# Altium schematic sheet Power_Board_R1.SchDoc
size C; SheetNumber: 2; SheetTotal: 2
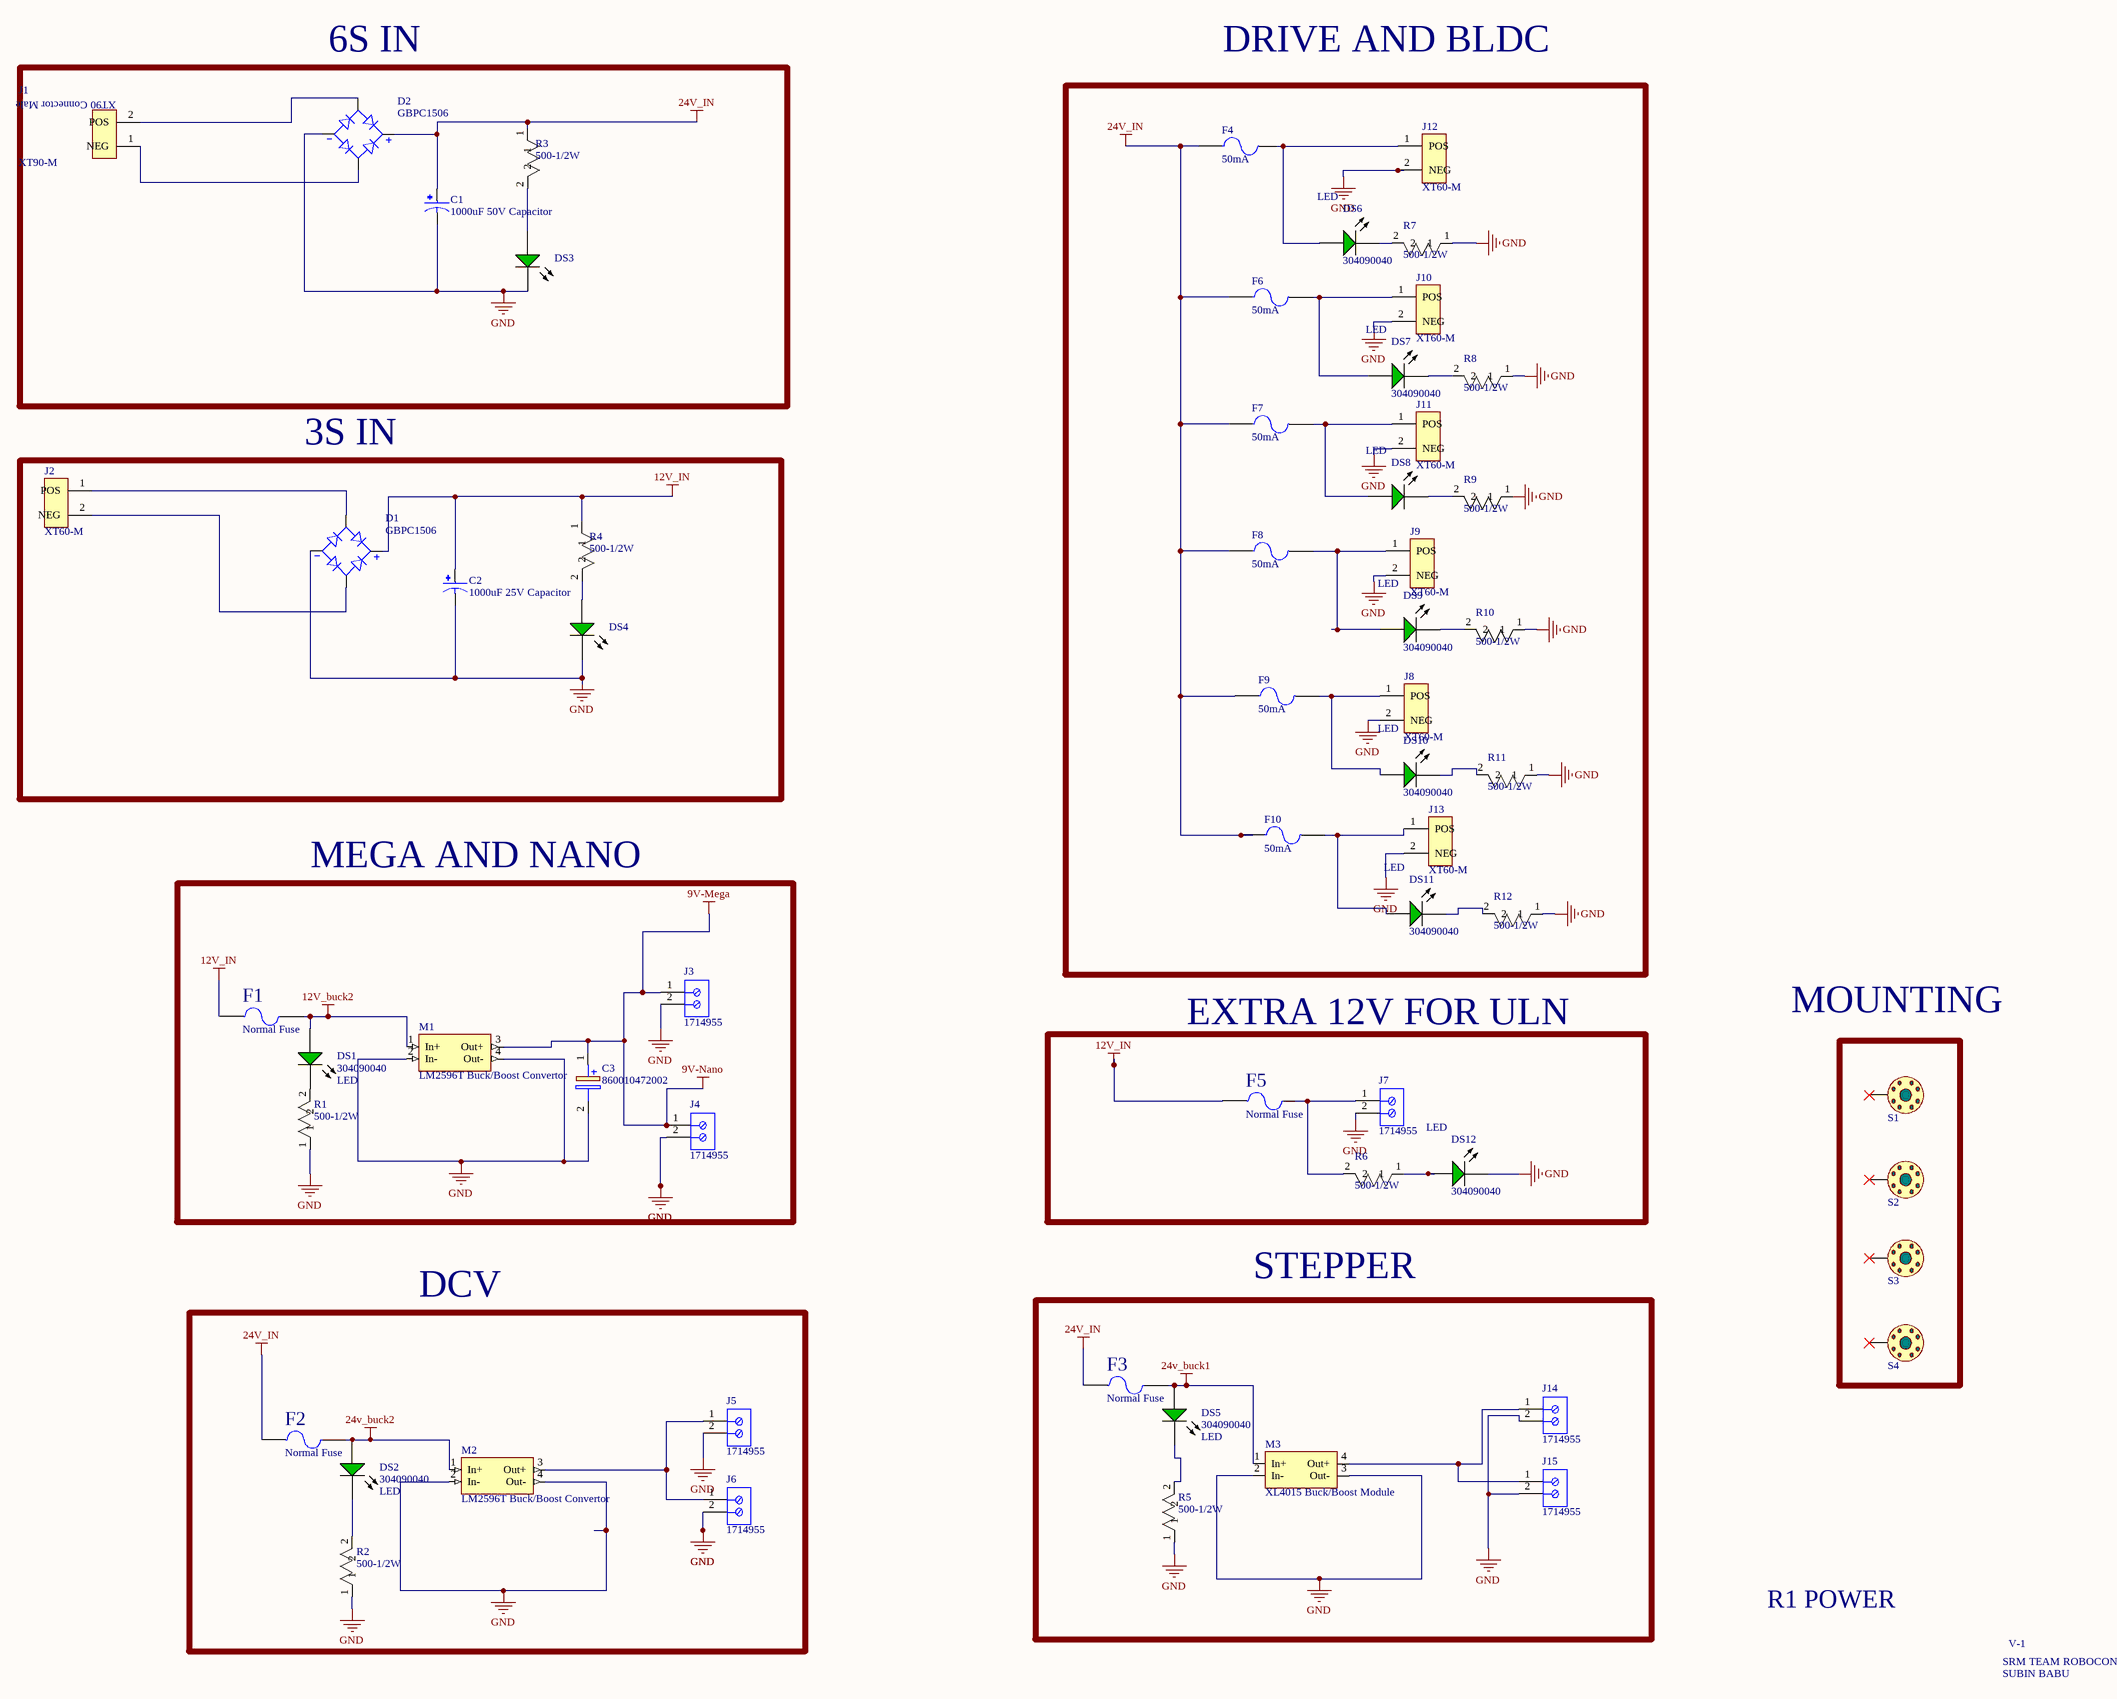
[diagram p0: Power_Board_R1.SchDoc]

## Parts
C1  1000uF 50V Capacitor  [1000uF 50V Capacitor]
C2  1000uF 25V Capacitor  [1000uF 25V Capacitor]
C3  860010472002  [CAPPRD200W52D500H1250]
D1  GBPC1506  [DIOB_GBPC1506]
D2  GBPC1506  [DIOB_GBPC1506]
DS1  304090040  Component Type: LED  [LED-2P-2.28-3MM]
DS2  304090040  Component Type: LED  [LED-2P-2.28-3MM]
DS3  (no value)  [LED-2P-2.28-3MM]
DS4  (no value)  [LED-2P-2.28-3MM]
DS5  304090040  Component Type: LED  [LED-2P-2.28-3MM]
DS6  304090040  Component Type: LED  [LED-2P-2.28-3MM]
DS7  304090040  Component Type: LED  [LED-2P-2.28-3MM]
DS8  Component Type: LED  [LED-2P-2.28-3MM]
DS9  304090040  Component Type: LED  [LED-2P-2.28-3MM]
DS10  304090040  Component Type: LED  [LED-2P-2.28-3MM]
DS11  304090040  Component Type: LED  [LED-2P-2.28-3MM]
DS12  304090040  Component Type: LED  [LED-2P-2.28-3MM]
F1  Normal Fuse  [Fuse]
F2  Normal Fuse  [Fuse]
F3  Normal Fuse  [Fuse]
F4  50mA  [FUSE(ALL SIZE)]
F5  Normal Fuse  [Fuse]
F6  50mA  [FUSE(ALL SIZE)]
F7  50mA  [FUSE(ALL SIZE)]
F8  50mA  [FUSE(ALL SIZE)]
F9  50mA  [FUSE(ALL SIZE)]
F10  50mA  [FUSE(ALL SIZE)]
J1  XT90-M  [XT90-M]
J2  XT60-M  [XT-60M]
J3  1714955  [6.35mm 2 Way Screw Terminal]
J4  1714955  [6.35mm 2 Way Screw Terminal]
J5  1714955  [6.35mm 2 Way Screw Terminal]
J6  1714955  [6.35mm 2 Way Screw Terminal]
J7  1714955  [6.35mm 2 Way Screw Terminal]
J8  XT60-M  [XT-60M]
J9  XT60-M  [XT-60M]
J10  XT60-M  [XT-60M]
J11  XT60-M  [XT-60M]
J12  XT60-M  [XT-60M]
J13  XT60-M  [XT-60M]
J14  1714955  [6.35mm 2 Way Screw Terminal]
J15  1714955  [6.35mm 2 Way Screw Terminal]
M1  LM2596T Buck/Boost Convertor  [LM2596 MODULE]
M2  LM2596T Buck/Boost Convertor  [LM2596 MODULE]
M3  XL4015 Buck/Boost Module  [XL4015 Module]
R1  500-1/2W  [R_Axial_DIN0309_L9.0mm_D3.2mm_P12.70mm_Horizontal]
R2  500-1/2W  [R_Axial_DIN0309_L9.0mm_D3.2mm_P12.70mm_Horizontal]
R3  500-1/2W  [R_Axial_DIN0309_L9.0mm_D3.2mm_P12.70mm_Horizontal]
R4  500-1/2W  [R_Axial_DIN0309_L9.0mm_D3.2mm_P12.70mm_Horizontal]
R5  500-1/2W  [R_Axial_DIN0309_L9.0mm_D3.2mm_P12.70mm_Horizontal]
R6  500-1/2W  [R_Axial_DIN0309_L9.0mm_D3.2mm_P12.70mm_Horizontal]
R7  500-1/2W  [R_Axial_DIN0309_L9.0mm_D3.2mm_P12.70mm_Horizontal]
R8  500-1/2W  [R_Axial_DIN0309_L9.0mm_D3.2mm_P12.70mm_Horizontal]
R9  500-1/2W  [R_Axial_DIN0309_L9.0mm_D3.2mm_P12.70mm_Horizontal]
R10  500-1/2W  [R_Axial_DIN0309_L9.0mm_D3.2mm_P12.70mm_Horizontal]
R11  500-1/2W  [R_Axial_DIN0309_L9.0mm_D3.2mm_P12.70mm_Horizontal]
R12  500-1/2W  [R_Axial_DIN0309_L9.0mm_D3.2mm_P12.70mm_Horizontal]
S1  Screw  [SCREW-3MM]  (value not drawn)  (net tie, no BOM)
S2  Screw  [SCREW-3MM]  (value not drawn)  (net tie, no BOM)
S3  Screw  [SCREW-3MM]  (value not drawn)  (net tie, no BOM)
S4  Screw  [SCREW-3MM]  (value not drawn)  (net tie, no BOM)

## Blocks framed on the sheet
6S IN: C1 D2 DS3 J1 R3
3S IN: C2 D1 DS4 J2 R4
MEGA AND NANO: C3 DS1 F1 J3 J4 M1 R1
EXTRA 12V FOR ULN: DS12 F5 J7 R6
STEPPER: DS5 F3 J14 J15 M3 R5
DCV: DS2 F2 J5 J6 M2 R2

## Nets
9V-Mega: C3.1(+) J3.1 J4.1 M1.3(Out+)  [also labelled 9V-Nano]
12V_buck2: DS1.1(A) F1.2 M1.1(In+)
12V_IN: C2.P D1.P F1.1 F5.1 R4.1
24v_buck1: DS5.1(A) F3.2 M3.1(In+)
24v_buck2: DS2.1(A) F2.2 M2.1(In+)
24V_IN: C1.P D2.P F2.1 F3.1 F4.2 F6.2 F7.2 F8.2 F9.2 F10.2 R3.1
GND: C1.N C2.N C3.2(-) D1.N D2.N DS3.2(K) DS4.2(K) DS12.2(K) J3.2 J4.2 J5.2 J6.2 J7.2 J8.2(NEG) J9.2(NEG) J10.2(NEG) J11.2(NEG) J12.2(NEG) J13.2(NEG) J14.2 J15.2 M1.2(In-) M1.4(Out-) M2.2(In-) M2.4(Out-) M3.2(In-) M3.3(Out-) R1.1 R2.1 R5.1 R7.1 R8.1 R9.1 R10.1 R11.1 R12.1
NetD1_AC1: D1.AC1 J2.2(NEG)
NetD1_AC2: D1.AC2 J2.1(POS)
NetD2_AC1: D2.AC1 J1.1(NEG)
NetD2_AC2: D2.AC2 J1.2(POS)
NetDS1_2: DS1.2(K) R1.2
NetDS2_2: DS2.2(K) R2.2
NetDS3_1: DS3.1(A) R3.2
NetDS4_1: DS4.1(A) R4.2
NetDS5_2: DS5.2(K) R5.2
NetDS6_1: DS6.1(A) F4.1 J12.1(POS)
NetDS6_2: DS6.2(K) R7.2
NetDS7_1: DS7.1(A) F6.1 J10.1(POS)
NetDS7_2: DS7.2(K) R8.2
NetDS8_1: DS8.1(A) F7.1 J11.1(POS)
NetDS8_2: DS8.2(K) R9.2
NetDS9_1: DS9.1(A) F8.1 J9.1(POS)
NetDS9_2: DS9.2(K) R10.2
NetDS10_1: DS10.1(A) F9.1 J8.1(POS)
NetDS10_2: DS10.2(K) R11.2
NetDS11_1: DS11.1(A) F10.1 J13.1(POS)
NetDS11_2: DS11.2(K) R12.2
NetDS12_1: DS12.1(A) R6.1
NetF5_2: F5.2 J7.1 R6.2
NetJ5_1: J5.1 J6.1 M2.3(Out+)
NetJ14_1: J14.1 J15.1 M3.4(Out+)

Not connected (* = marked no-connect by the designer): S1 0*; S2 0*; S3 0*; S4 0*

## Notes on the sheet
- DRIVE AND BLDC
- MOUNTING
- R1 POWER
- SUBIN BABU
- SRM TEAM ROBOCON
- V-1
- (in symbol XT90-M) XT90 Connector Male

## Library data of the parts
C1 = 1000uF 50V Capacitor: CAP ALUM 1000UF 20% 50V RADIAL; MF: Panasonic; MP: EEU-HD1H102B; Availability: In Stock; Check_prices: https://www.snapeda.com/parts/EEU-HD1H102B/Panasonic/view-part/2335470/?ref=eda; Package: RADIAL-2 Panasonic; Price: None; SnapEDA_Link: https://www.snapeda.com/parts/EEU-HD1H102B/Panasonic/view-part/2335470/?ref=snap; Value: *
C2 = 1000uF 25V Capacitor: CAP ALUM 1000UF 20% 25V RADIAL; MP: EEUTA1E102LB; MF: Panasonic; Package: RADIAL-2 Panasonic; Availability: No availability data; Price: None; Check_prices: https://www.snapeda.com/parts/EEUTA1E102LB/Panasonic/view-part/5789306/?ref=eda; SnapEDA_Link: https://www.snapeda.com/parts/EEUTA1E102LB/Panasonic/view-part/5789306/?ref=snap; Value: *
C3 = 860010472002: Capacitor Polarised; Manufacturer_Name: Wurth Elektronik; Datasheet Link: https://www.we-online.com/catalog/datasheet/860010472002.pdf; Height: 12.5mm; Manufacturer_Part_Number: 860010472002; Mouser Part Number: 710-860010472002; Mouser Price/Stock: https://www.mouser.co.uk/ProductDetail/Wurth-Elektronik/860010472002?qs=0KOYDY2FL2%2FyXlauDHcLjg%3D%3D
D1 D2 = GBPC1506: Bridge Rectifier Single Phase Standard 600 V QC Terminal GBPC; MF: ON Semiconductor; SnapEDA_Link: https://www.snapeda.com/parts/GBPC1506/Onsemi/view-part/?ref=snap; Package: GBPC-4 ON Semiconductor; MP: GBPC1506; Purchase-URL: https://pricing.snapeda.com/search/part/GBPC1506/?ref=eda; Check_prices: https://www.snapeda.com/parts/GBPC1506/Onsemi/view-part/?ref=eda; Price: None; Value: *; Availability: In Stock
DS1-DS12 = CMP-007-00006-1: Green LED, 80 mW, 20 mA, -25 to 85 degC, 2-Pin THD; Manufacturer: Shenzhen CGX; Mounting Technology: TH; Case/Package: 304090040; Package Description: 2-Pin Through Hole Device, Dia 3 mm, Pitch 2.28 mm; RoHS Compliant: Unknown; Package Reference: 304090040; Datasheet Version: Rev. 1.0, 09/2014; Manufacturer URL: http://szcgx.com/; Datasheet URL: http://datasheet.octopart.com/304090040-Chengguangxing-datasheet-62330655.pdf
F1-F3 F5 = Fuse_1
F4 F6-F10 = Fuse
J2 J8-J13 = XT60-M: Plug; DC supply; XT60; male; PIN: 2; for cable; soldered; 30A; 500V; MF: AMASS; MP: XT60-M; Price: None; Package: Package Analog Devices; Value: *; Availability: Unavailable; SnapEDA_Link: https://www.snapeda.com/parts/XT60-M/AMASS/view-part/2883912/?ref=snap
J3-J7 J14 J15 = 6.35mm 2 Way Screw Terminal: PC Terminal Block, Pitch 6.35 mm, 1 x 2 Position, Height 21.5 mm, Tail Lenght 5.1 mm, RoHS, Bulk; Manufacturer: Phoenix Contact; Manufacturer URL: http://www.phoenixcontact.com/; Datasheet URL: http://media.digikey.com/pdf/Data%20Sheets/Phoenix%20Contact%20PDFs/1714955.pdf; Package Description: PC Terminal Block, Pitch 6.35 mm, 1 x 2 Position, Height 21.5 mm, Tail Lenght 5.1 mm; Datasheet Version: 02/2010; Mounting Technology: ThroughHole; Package Reference: 1714955
R1-R12 = 1/2 watt Resistor
S1-S4 = Screw: 3mm Screw; ASiD Part Number: Screw-AS